# EAGLE design Hyundai_Giraffe (EAGLE 9.0.1)
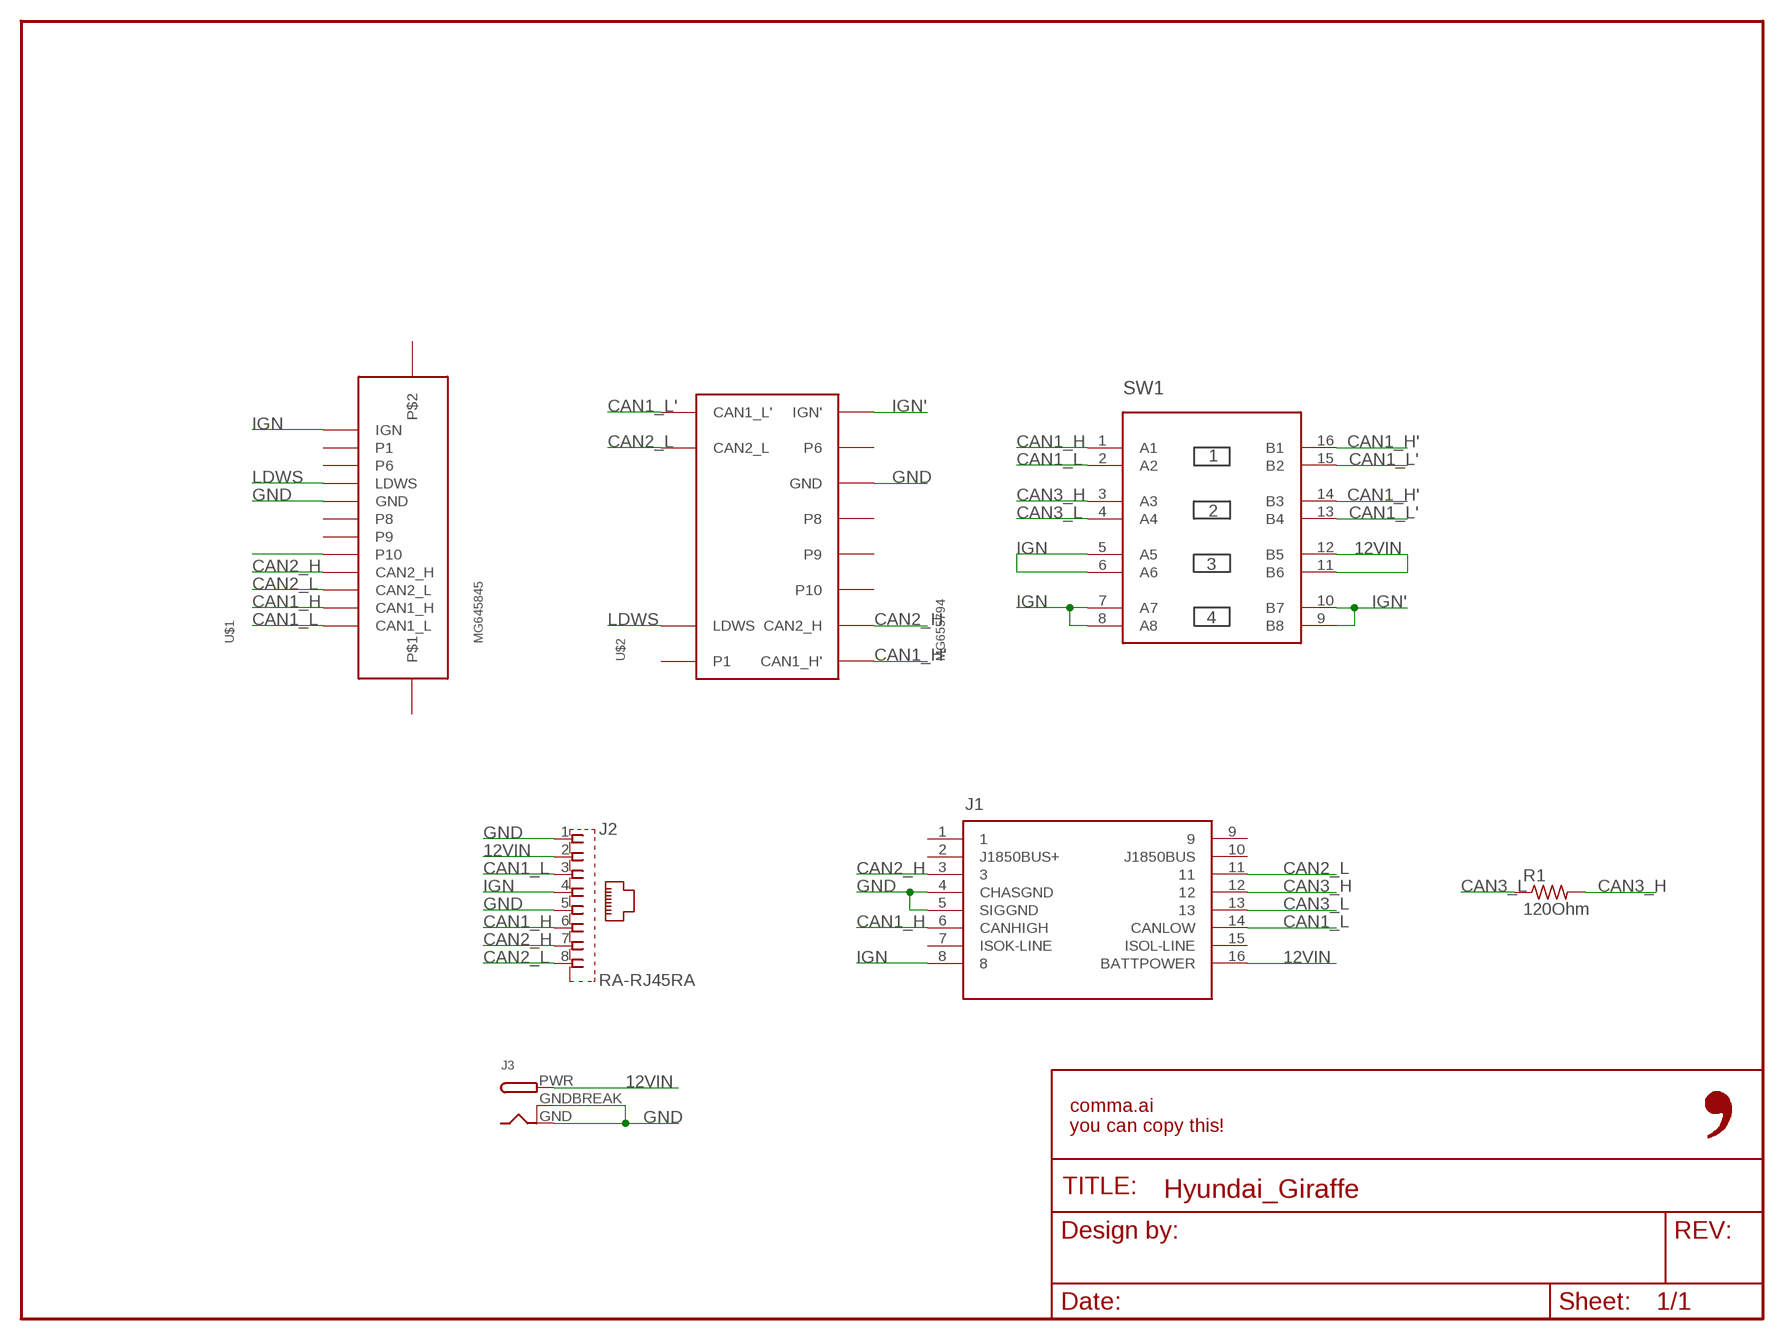
[diagram p0: schematic, sheet 1]

## Parts
FRAME1  FRAME-LETTER-OPENNO_PACKAGE  [DUMMY]
J1  OBDII-FEMALE-CUT  [OBDII-FEMALE-MIDCUT]
J2  RA-RJ45RA  [RA-RJ45]
J3  DCBARRELPTH  [DCJACK_2MM_PTH]
R1  120Ohm  R0603  [0603-R]
SW1  4XDPSTSMT  [4-DPST]
U$1  MG645845  [MG645845]
U$2  MG655794  [MG655794]

## Nets
12VIN: J1.16(BATTPOWER) J2.2 J3.PWR SW1.11(B6) SW1.12(B5)
CAN1_H: J1.6(CANHIGH) J2.6 SW1.1(A1) U$1.CAN1_H
CAN1_H': SW1.14(B3) SW1.16(B1) U$2.CAN1_H'
CAN1_L: J1.14(CANLOW) J2.3 SW1.2(A2) U$1.CAN1_L
CAN1_L': SW1.13(B4) SW1.15(B2) U$2.CAN1_L'
CAN2_H: J1.3 J2.7 U$1.CAN2_H U$2.CAN2_H
CAN2_L: J1.11 J2.8 U$1.CAN2_L U$2.CAN2_L
CAN3_H: J1.12 R1.2 SW1.3(A3)
CAN3_L: J1.13 R1.1 SW1.4(A4)
GND: J1.4(CHASGND) J1.5(SIGGND) J2.1 J2.5 J3.GND J3.GNDBREAK U$1.GND U$2.GND
IGN: J1.8 J2.4 SW1.5(A5) SW1.6(A6) SW1.7(A7) SW1.8(A8) U$1.IGN
IGN': SW1.9(B8) SW1.10(B7) U$2.IGN'
LDWS: U$1.LDWS U$2.LDWS
N$8: U$1.P10
Unconnected: J1.1 J1.2(J1850BUS+) J1.7(ISOK-LINE) J1.9 J1.10(J1850BUS) J1.15(ISOL-LINE) U$1.P1 U$1.P6 U$1.P8 U$1.P9 U$1.P$1 U$1.P$2 U$2.P1 U$2.P6 U$2.P8 U$2.P9 U$2.P10

## Library data of the parts
FRAME1 = comma.ai:FRAME-LETTER-OPEN: Schematic Frame - Letter Standard 8.5x11 US Letter frame; DESIGNER: Nobody; VERSION: v01
J1 = comma.ai:OBDII-FEMALE
J2 = comma.ai:RA-RJ45
J3 = comma.ai:DCBARREL: 2.0mm DC Barrel Jack DCJACK_2MM_PTH - Through Hole Jack (4UConnector: 05537)
R1 = comma.ai:R
SW1 = comma.ai:4XDPST
U$1 = MG645845:MG645845
U$2 = MG645845:MG655794

## Board
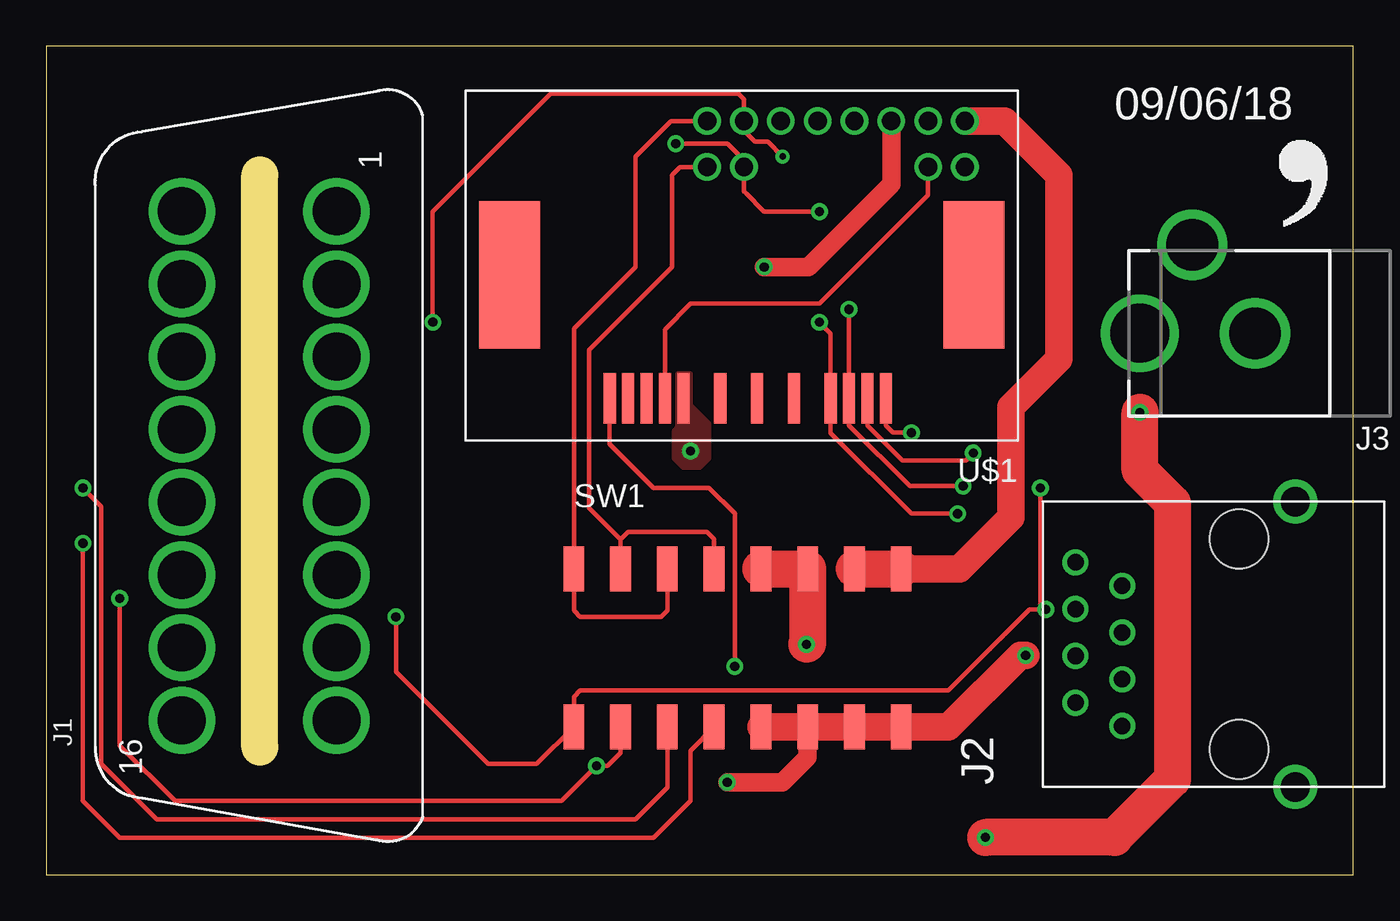
[diagram p1: board, top side]
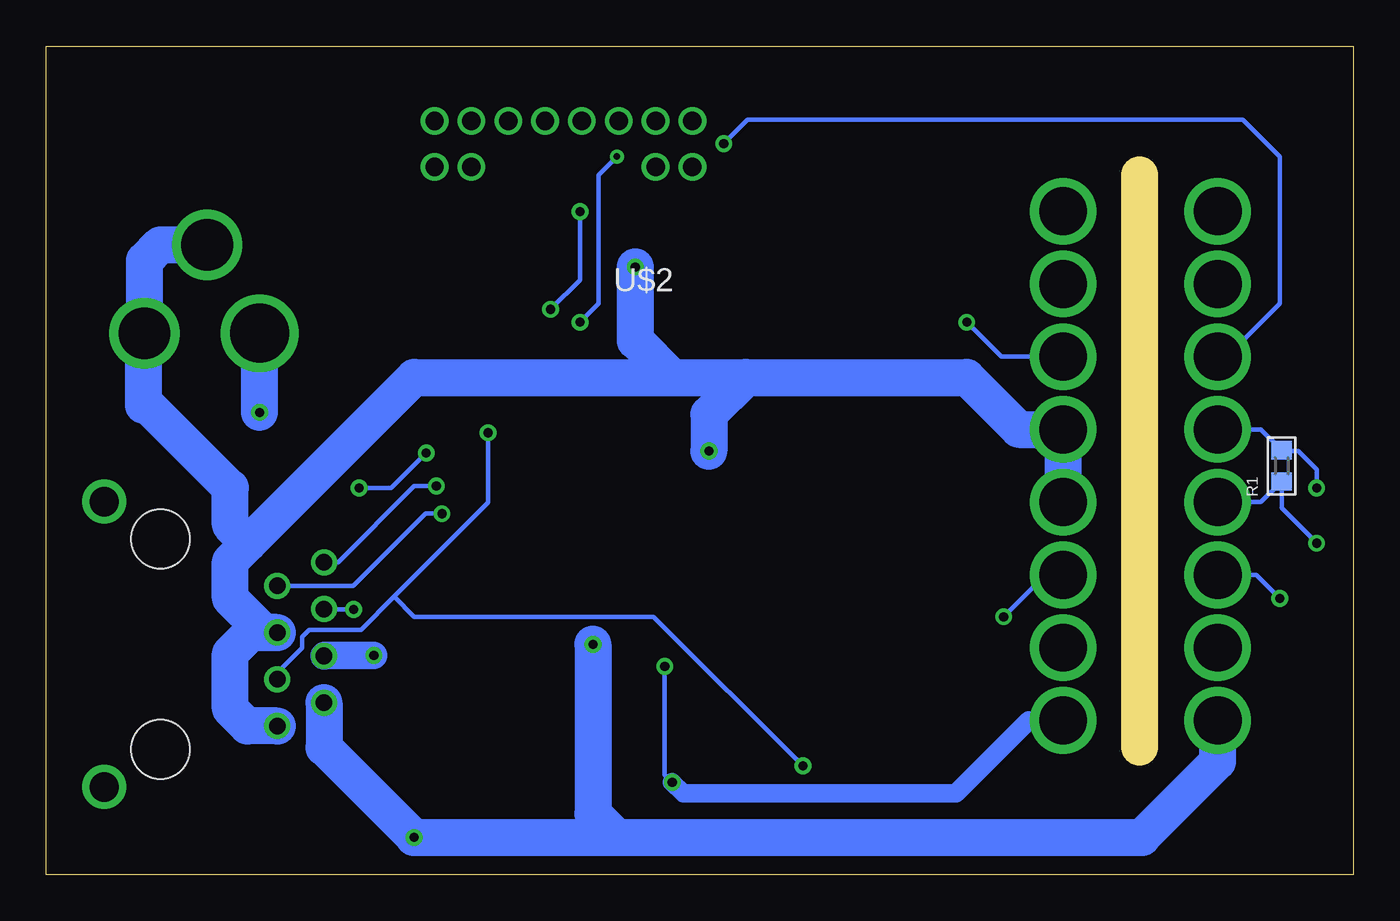
[diagram p2: board, bottom side, seen from below]

Size 71 x 45 mm. Coordinates in mm from the lower left corner, seen from the top.
Outline: 11.61,6.91 11.61,38
Outline: 0,0 71,0 71,45 0,45 0,0
Copper layers (1*16): Top 0.035mm / dielectric 1.5mm / Bottom 0.035mm
Design rules "default": minimum track width 6mil, minimum drill 0.35mm, track to track 6mil, track to pad 6mil, pad to pad 6mil, via to via 6mil, smd to smd 6mil, copper to edge 40mil, drill to drill 6mil, minimum pad ring 10mil, minimum via ring 8mil, stop-mask expansion 4mil, vias tented up to drill 0mil, thermal gap 10mil

### Footprints (pad centres in the part's own frame; a part is rotated, then mirrored left to right if it is on the bottom)
OBDII-FEMALE-MIDCUT = drill 2.6 pad 3.4: 1 13.825,-4.2; 2 9.875,-4.2; 3 5.925,-4.2; 4 1.975,-4.2; 5 -1.975,-4.2; 6 -5.925,-4.2; 7 -9.875,-4.2; 8 -13.825,-4.2; 9 13.825,4.2; 10 9.875,4.2; 11 5.925,4.2; 12 1.975,4.2; 13 -1.975,4.2; 14 -5.925,4.2; 15 -9.875,4.2; 16 -13.825,4.2
RA-RJ45 = drill 0.9: 1 -4.445,6.35; 2 -3.175,8.89; 3 -1.905,6.35; 4 -0.635,8.89; 5 0.635,6.35; 6 1.905,8.89; 7 3.175,6.35; 8 4.445,8.89 | drill 1.6: P$1 -7.75,-3.05; P$2 7.75,-3.05 | hole 3.2: -5.715,0; 5.715,0
DCJACK_2MM_PTH = drill 2.8: GND 0,7.35; GNDBREAK 4.8,10.75 | drill 3.2: PWR 0,13.6
0603-R = smd 1 x 1.1: 1 -0.85,0; 2 0.85,0
4-DPST = smd 1.13 x 2.44: 1 -8.89,-4.3; 2 -6.35,-4.3; 3 -3.81,-4.3; 4 -1.27,-4.3; 5 1.27,-4.3; 6 3.81,-4.3; 7 6.35,-4.3; 8 8.89,-4.3; 9 8.89,4.3; 10 6.35,4.3; 11 3.81,4.3; 12 1.27,4.3; 13 -1.27,4.3; 14 -3.81,4.3; 15 -6.35,4.3; 16 -8.89,4.3
MG645845 = smd 0.66 x 2.75: CAN1_H -6.83,6.72; CAN1_L -7.83,6.72; CAN2_H -4.83,6.72; CAN2_L -5.83,6.72; GND 3.17,6.72; IGN 7.17,6.72; LDWS 4.17,6.72; P1 6.17,6.72; P6 5.17,6.72; P8 1.17,6.72; P9 -0.83,6.72; P10 -2.83,6.72 | smd 3.32 x 8: P$1 -12.6,0; P$2 12.6,0
MG655794 = drill 1: CAN1_H' -7,0; CAN1_L' -7,2.5; CAN2_H -5,0; CAN2_L -5,2.5; GND 3,0; IGN' 7,0; LDWS 5,2.5; P1 7,2.5; P6 5,0; P8 1,0; P9 -1,0; P10 -3,0

### Placement (x,y rotation side)
FRAME1  -8,-48 0 top  (outside the outline)
J1  11.57,22.2 90 top
J2  64.79,12.51 90 top
J3  73,29.4 90 top
R1  3.9,22.2 90 bottom
SW1  37.55,12.31 0 top
U$1  37.78,32.58 180 top
U$2  42.9,40.93 180 bottom
U$3  [LOGO]  66.3,34.9 0 top

### Tracks (layer width: path | path; a pad name or v marks a point on that pad's centre or on a via)
12VIN  (via drill 0.5)
  Top 1: 41.36,16.44 SW1.11
  Top 2: SW1.12 SW1.11 41.36,12.56 v41.3,12.5 | v59.4,25.1 59.4,21.95 61.17,20.17 61.17,5.17 58.02,2.02 v51.02,2.02
  Bottom 2: J1.16 7.37,6.13 11.49,2.02 40,2.02 | J2.2 55.9,6.9 v51.02,2.02 40,2.02 | v41.3,12.5 41.3,3.32 40,2.02 | v59.4,25.1 J3.PWR
CAN1_H  (via drill 0.5)
  Top 0.25: v19,14 19,11 24,6 26.65,6 SW1.1 28.66,9.66 29,10 49,10 53.4,14.4 v54.3,14.4 54,14.7 v54,21 | v50.35,22.9 49.95,22.5 46.5,22.5 44.61,24.39 U$1.CAN1_H
  Bottom 0.25: v19,14 16.73,16.27 J1.6 | v54.3,14.4 55.89,14.4 J2.6 | 53.95,21 v54,21 52.25,21 v50.35,22.9
CAN1_H'
  Top 0.25: SW1.14 33.74,14.34 33.4,14 29,14 28.66,14.34 SW1.16 28.66,29.66 32,33 32,39 33.93,40.93 U$2.CAN1_H'
CAN1_L  (via drill 0.5)
  Top 0.25: 31.2,7.2 SW1.2 31.2,6.6 30.5,5.9 v29.9,5.9 28,4 7,4 4,7 v4,15 | v47,24 46,24 45.61,24.39 U$1.CAN1_L
  Bottom 0.25: 52.1,15.1 51,14 38,14 v29.9,5.9 | J1.14 5.27,16.27 v4,15 | 52.1,15.1 53.9,13.3 56.7,13.3 57.1,12.9 57.1,12.3 58.44,10.96 J2.3 | 52.1,15.1 48.1,19.1 47.7,19.5 47,20.2 v47,24
CAN1_L'
  Top 0.25: SW1.15 31.2,18.2 | 31.2,18.2 31.6,18.6 35.9,18.6 36.28,18.22 SW1.13 | 31.2,18.2 29.5,19.9 29.5,28.5 34,33 34,38 34.43,38.43 U$2.CAN1_L'
CAN2_H  (via drill 0.35, 0.5)
  Top 0.25: v21,30 21,36 27.4,42.4 37.6,42.4 37.9,42.1 U$2.CAN2_H 37.9,40.4 38.5,39.8 39.2,39.8 v40,39 | v49.5,19.6 47,19.6 42.61,23.99 U$1.CAN2_H 42.61,29.39 v42,30
  Bottom 0.25: J2.7 54.31,15.69 50.4,19.6 v49.5,19.6 | v21,30 19.12,28.12 J1.3 | v42,30 41,31 41,38 v40,39
CAN2_L  (via drill 0.5)
  Top 0.25: v34.2,39.7 37,39.7 37.9,38.8 U$2.CAN2_L 37.9,37.1 38,37 39,36 v42,36 | v49.8,21.1 46.9,21.1 43.61,24.39 U$1.CAN2_L v43.61,30.69 v43.6,30.7
  Bottom 0.25: J1.11 6.88,28.12 4,31 4,39 6,41 32.9,41 v34.2,39.7 | J2.8 55.14,16.95 51,21.1 v49.8,21.1 | v43.6,30.7 42,32.3 v42,36
CAN3_H  (via drill 0.5)
  Top 0.25: SW1.3 33.74,4.74 32,3 6,3 3,6 3,20 v2,21
  Bottom 0.25: J1.12 5.02,24.17 R1.2 3.85,23 3,23 2,22 v2,21
CAN3_L  (via drill 0.5)
  Top 0.25: SW1.4 35,6.73 35,4 33,2 4,2 2,4 v2,18
  Bottom 0.25: R1.1 5.02,20.23 J1.13 | 3.9,21 R1.1 | R1.1 3.9,19.9 v2,18
GND  (via drill 0.5)
  Top 1.016: v39,33 41.4,33 45.9,37.5 U$2.GND
  Bottom 2: J1.4 J1.5 | J2.1 60.06,8.06 61,9 61,12 59.86,13.15 J2.5 59.14,13.15 61,15 61,17 60,18 | 60,18 51,27 37,27 | 15.84,24.1 J1.4 | J1.4 18.17,24.17 21,27 33,27 | 37,27 33,27 | 37,27 39,29 v39,33 | 60,18 61,19 61,21 65.5,25.5 65.7,25.5 65.7,29.35 J3.GND 65.65,33.35 64.8,34.2 J3.GNDBREAK | 33,27 35,25 v35,23
  pour Top (no thermals): 34.3,27.2 34.3,24.3 34.1,24.1 34.1,22.9 34.1,22.6 34.4,22.3 34.6,22.1 35,22.1 35.4,22.1 35.5,22.1 35.8,22.4 36,22.6 36,23 36,24.1 36,24.5 35.9,24.6 35,25.5 35,25.6 35,27.2
IGN  (via drill 0.5)
  Top 0.25: v37.4,11.3 37.4,19.6 36,21 33,21 30.61,23.39 U$1.IGN
  Top 1: v36.99,5.01 39,5.01 39,5 40,5 41.36,6.36 SW1.6
  Top 1.5: v53.2,11.9 52.9,11.9 49.01,8.01 SW1.8 SW1.7 SW1.6 SW1.5
  Bottom 0.25: v36.99,5.01 37.4,5.41 v37.4,11.3
  Bottom 1: J1.8 17.62,8.38 21.6,4.4 36.39,4.4 v36.99,5.01
  Bottom 1.5: v53.2,11.9 55.88,11.9 J2.4
IGN'
  Top 1.5: SW1.9 49.61,16.61 52.4,19.4 52.4,25.4 55,28 55,38 52.07,40.93 U$2.IGN'
  Top 2: SW1.10 SW1.9
LDWS
  Top 0.25: U$1.LDWS 33.61,29.61 35,31 42,31 47.9,36.9 U$2.LDWS

### Text on the board
tNames: 09/06/18